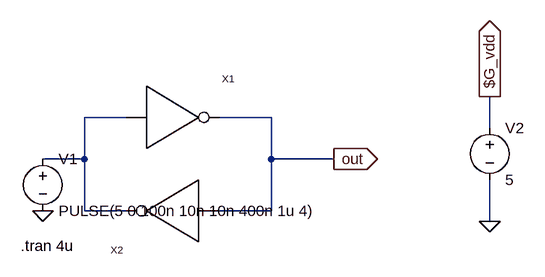
[diagram p0: schematic inv_latch.asc]
inv_latch.asc, the LTspice schematic file:
Version 4
SHEET 1 880 680
WIRE 144 80 80 80
WIRE 368 80 288 80
WIRE 704 96 704 48
WIRE 80 144 80 80
WIRE 80 144 16 144
WIRE 368 144 368 80
WIRE 464 144 368 144
WIRE 80 224 80 144
WIRE 144 224 80 224
WIRE 368 224 368 144
WIRE 368 224 288 224
WIRE 704 240 704 176
FLAG 464 144 out
IOPIN 464 144 Out
FLAG 16 224 0
FLAG 704 240 0
FLAG 704 48 $G_vdd
IOPIN 704 48 Out
SYMBOL inverter 176 80 R0
SYMATTR InstName X1
SYMBOL inverter 256 224 R180
SYMATTR InstName X2
SYMBOL voltage 16 128 R0
WINDOW 123 0 0 Left 0
WINDOW 39 0 0 Left 0
SYMATTR InstName V1
SYMATTR Value PULSE(5 0 100n 10n 10n 400n 1u 4)
SYMBOL voltage 704 80 R0
SYMATTR InstName V2
SYMATTR Value 5
TEXT -18 278 Left 2 !.tran 4u

The netlist it stands for:
* inv_latch.asc
XX1 N001 out inverter  ; pins Vin Vout
XX2 out N001 inverter  ; pins Vin Vout
V1 N001 0 PULSE(5 0 100n 10n 10n 400n 1u 4)
V2 $G_vdd 0 5
.tran 4u
.backanno
.end